# EAGLE design board (EAGLE 9.6.2)
CDESIGNER: Kihun Song; CNAME: IR-Controller-Board; CREVISION: V1.0
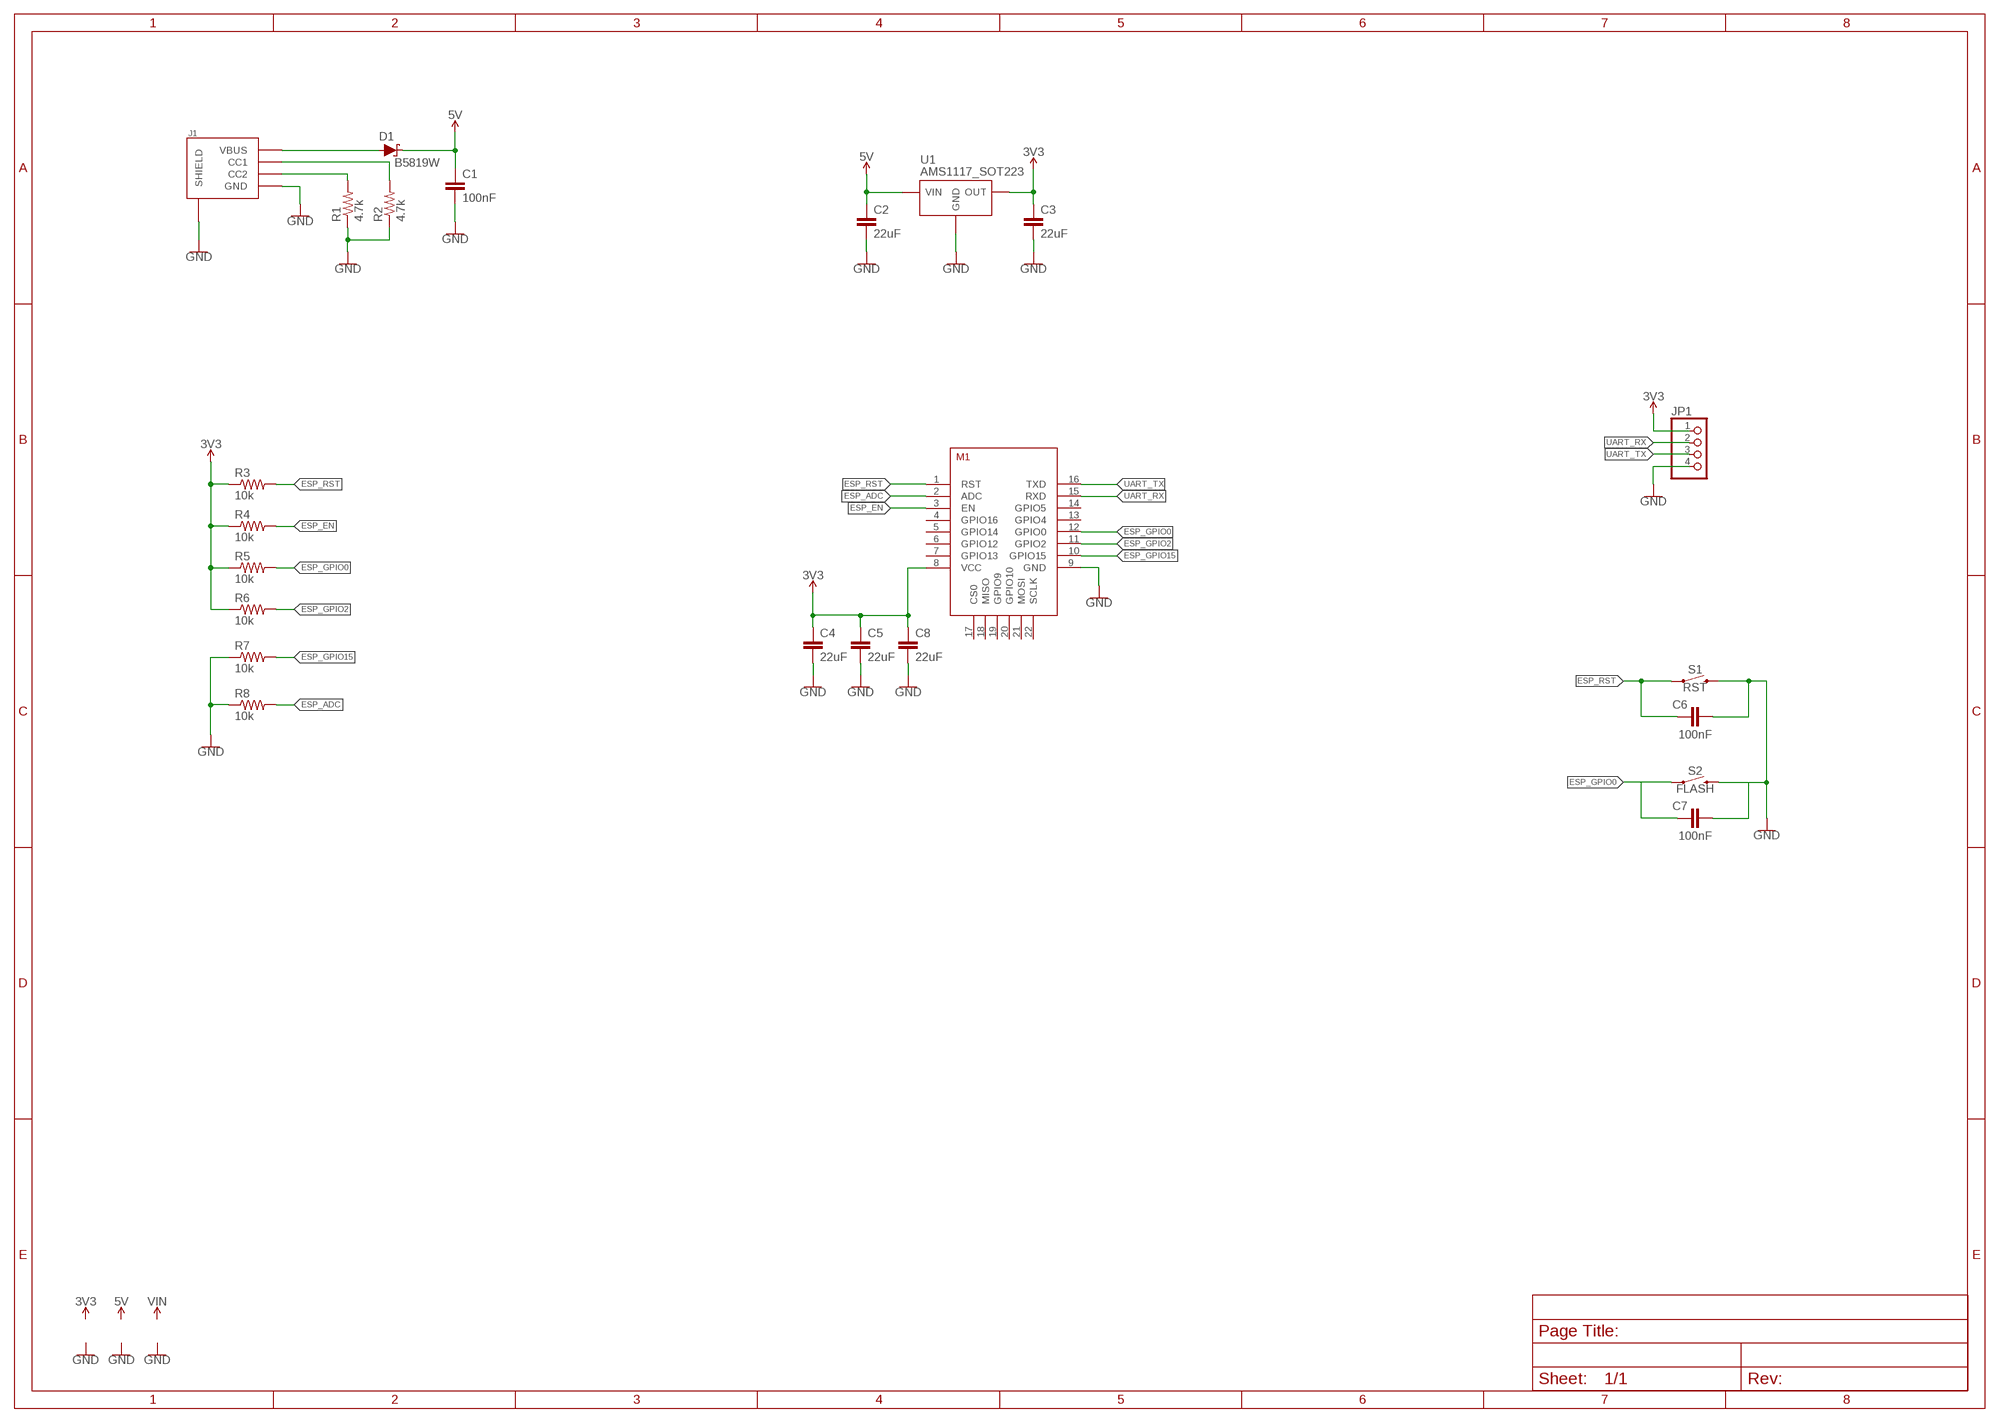
[diagram p0: schematic, sheet 1]

## Parts
C1  100nF  C-NON-POLC0402  [C0402]
C2  22uF  C-NON-POLC0805  [C0805]
C3  22uF  C-NON-POLC0805  [C0805]
C4  22uF  C-NON-POLC0805  [C0805]
C5  22uF  C-NON-POLC0805  [C0805]
C6  100nF  C-NON-POLC0402  [C0402]
C7  100nF  C-NON-POLC0402  [C0402]
C8  22uF  C-NON-POLC0805  [C0805]
D1  B5819W  DIODE-SCHOTTKY_SOD-123  [SOD-123]
J1  USB-TYPE-C-31-M-17  [USB-TYPE-C-31-M-17]
JP1  PINHD-1X4  [1X04]
M1  ESP8266-12E  [ESP8266-ESP12E]
R1  4.7k  RR0402  [R0402]
R2  4.7k  RR0402  [R0402]
R3  10k  RR0402  [R0402]
R4  10k  RR0402  [R0402]
R5  10k  RR0402  [R0402]
R6  10k  RR0402  [R0402]
R7  10k  RR0402  [R0402]
R8  10k  RR0402  [R0402]
S1  RST  SWITCH-SPST-SMD-3.0X4.0MM  [TACTILE_SWITCH_SMD_3.0X4.0MM]
S2  FLASH  SWITCH-SPST-SMD-3.0X4.0MM  [TACTILE_SWITCH_SMD_3.0X4.0MM]
U1  AMS1117_SOT223  [SOT-223]

## Nets
3V3 [power]: C3.1 C4.1 C5.1 C8.1 JP1.1 M1.8(VCC) R3.1 R4.1 R5.1 R6.1 U1.2(OUT) U1.4(OUT)
5V [power]: C1.1 C2.1 D1.C U1.3(VIN)
5V_IN1 [power]: D1.A J1.VBUS J1.VBUS_2(VBUS)
ESP_ADC: M1.2(ADC) R8.2
ESP_EN: M1.3(EN) R4.2
ESP_GPIO0: M1.12(GPIO0) R5.2 S2.1
ESP_GPIO2: M1.11(GPIO2) R6.2
ESP_GPIO15: M1.10(GPIO15) R7.2
ESP_RST: C6.1 M1.1(RST) R3.2 S1.1
ESP_RST1: C7.1
GND [power]: C1.2 C2.2 C3.2 C4.2 C5.2 C6.2 C8.2 J1.GND J1.GND_2(GND) J1.SHLD-B1(SHIELD) J1.SHLD-B2(SHIELD) J1.SHLD-B3(SHIELD) J1.SHLD-B4(SHIELD) J1.SHLD-T1(SHIELD) J1.SHLD-T2(SHIELD) J1.SHLD-T3(SHIELD) J1.SHLD-T4(SHIELD) JP1.4 M1.9(GND) R1.1 R2.1 R7.1 R8.1 S1.2 S2.2 U1.1(GND)
GND1 [power]: C7.2
N$1: J1.CC1 R2.2
N$2: J1.CC2 R1.2
UART_RX: JP1.2 M1.15(RXD)
UART_TX: JP1.3 M1.16(TXD)
Unconnected: M1.4(GPIO16) M1.5(GPIO14) M1.6(GPIO12) M1.7(GPIO13) M1.13(GPIO4) M1.14(GPIO5) M1.17(CS0) M1.18(MISO) M1.19(GPIO9) M1.20(GPIO10) M1.21(MOSI) M1.22(SCLK)

## Library data of the parts
C1 C6 C7 = angrypig7-RCL:C-NON-POL; LCSC: C1525; SPICEPREFIX: C
C2-C5 C8 = angrypig7-RCL:C-NON-POL; LCSC: C45783; SPICEPREFIX: C
D1 = angrypig7-Diodes:DIODE-SCHOTTKY; LCSC: C8598
J1 = angrypig7-Connectors-USB:USB-TYPE-C-31-M-17: Type-C-31-M16/17 By Korean Hroparts Elec link <https://lcsc.com/product-detail/Others_Korean-Hroparts-Elec-TYPE-C-31-M-17_C283540.html>
JP1 = angrypig7-Connectors-PinHeads:PINHD-1X4: PIN HEADER
M1 = angrypig7-Boards:ESP8266-12E
R1 R2 = angrypig7-RCL:R; LCSC: C25900; SPICEPREFIX: R
R3-R8 = angrypig7-RCL:R; SPICEPREFIX: R
S1 S2 = angrypig7-Switches:SWITCH-SPST; LCSC: C720477
U1 = angrypig7-IC-Power:AMS1117; LCSC: C6186

## Net classes
0 default: width 0.203 mm
1 power: width 0.406 mm

## Board
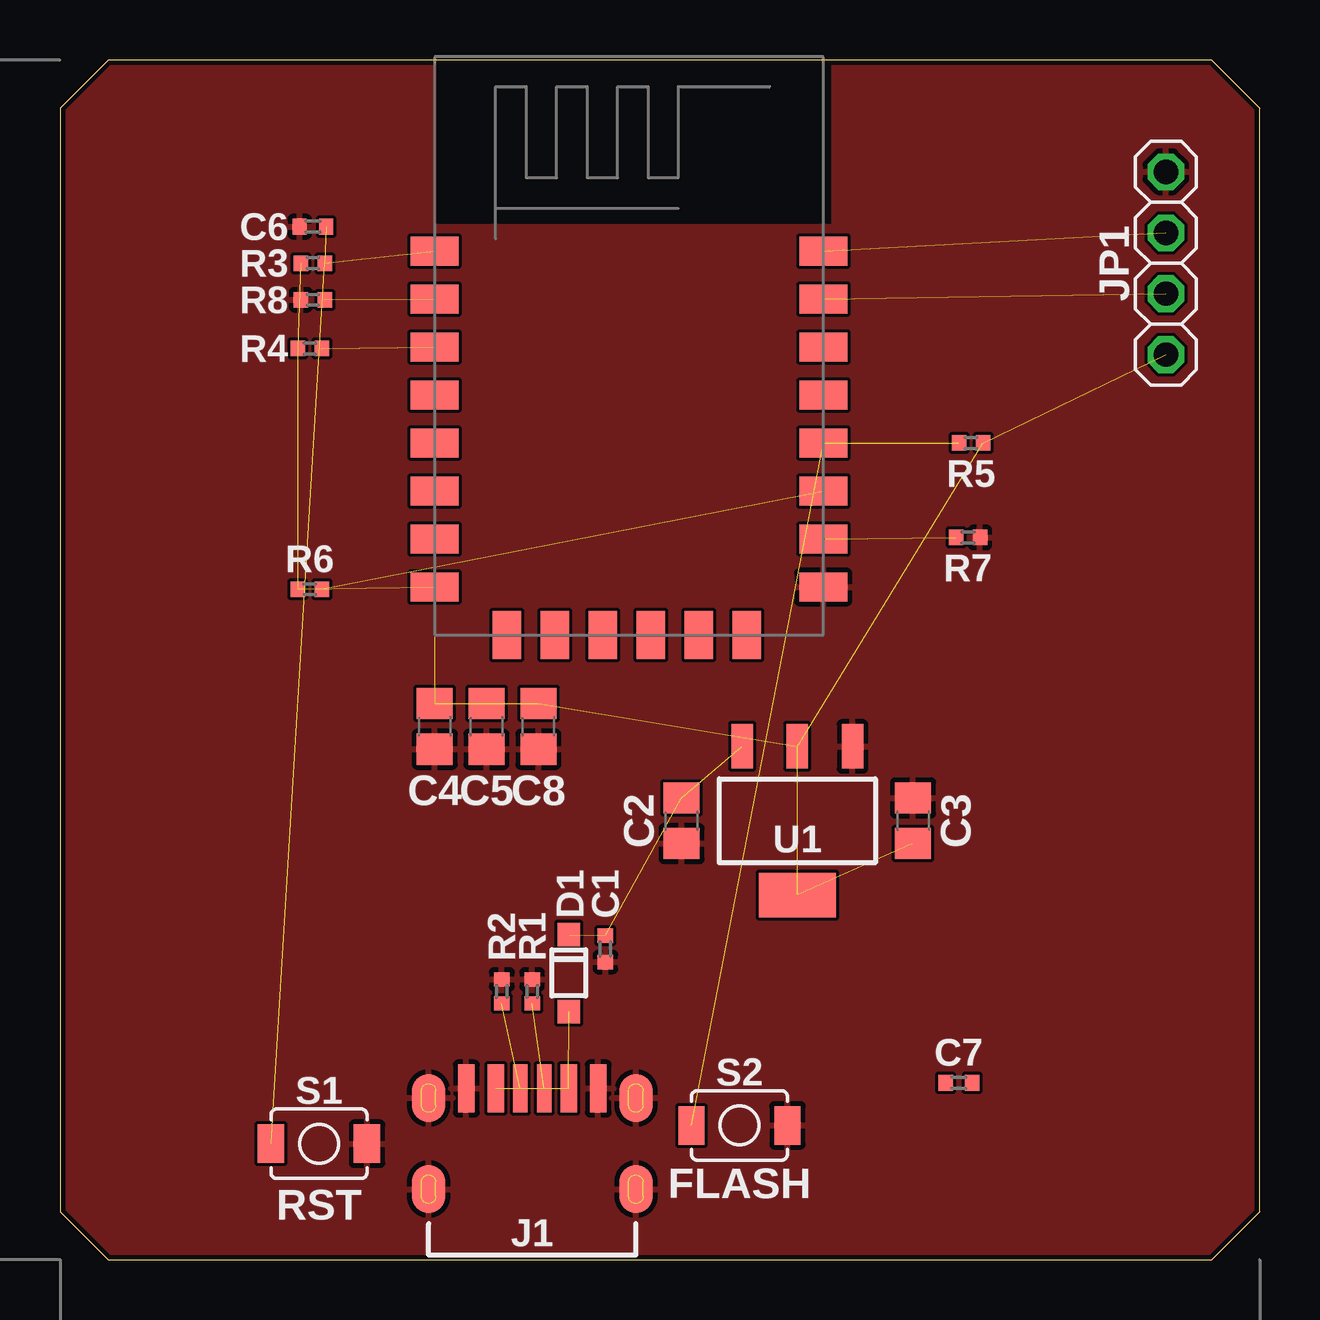
[diagram p1: board, top side]
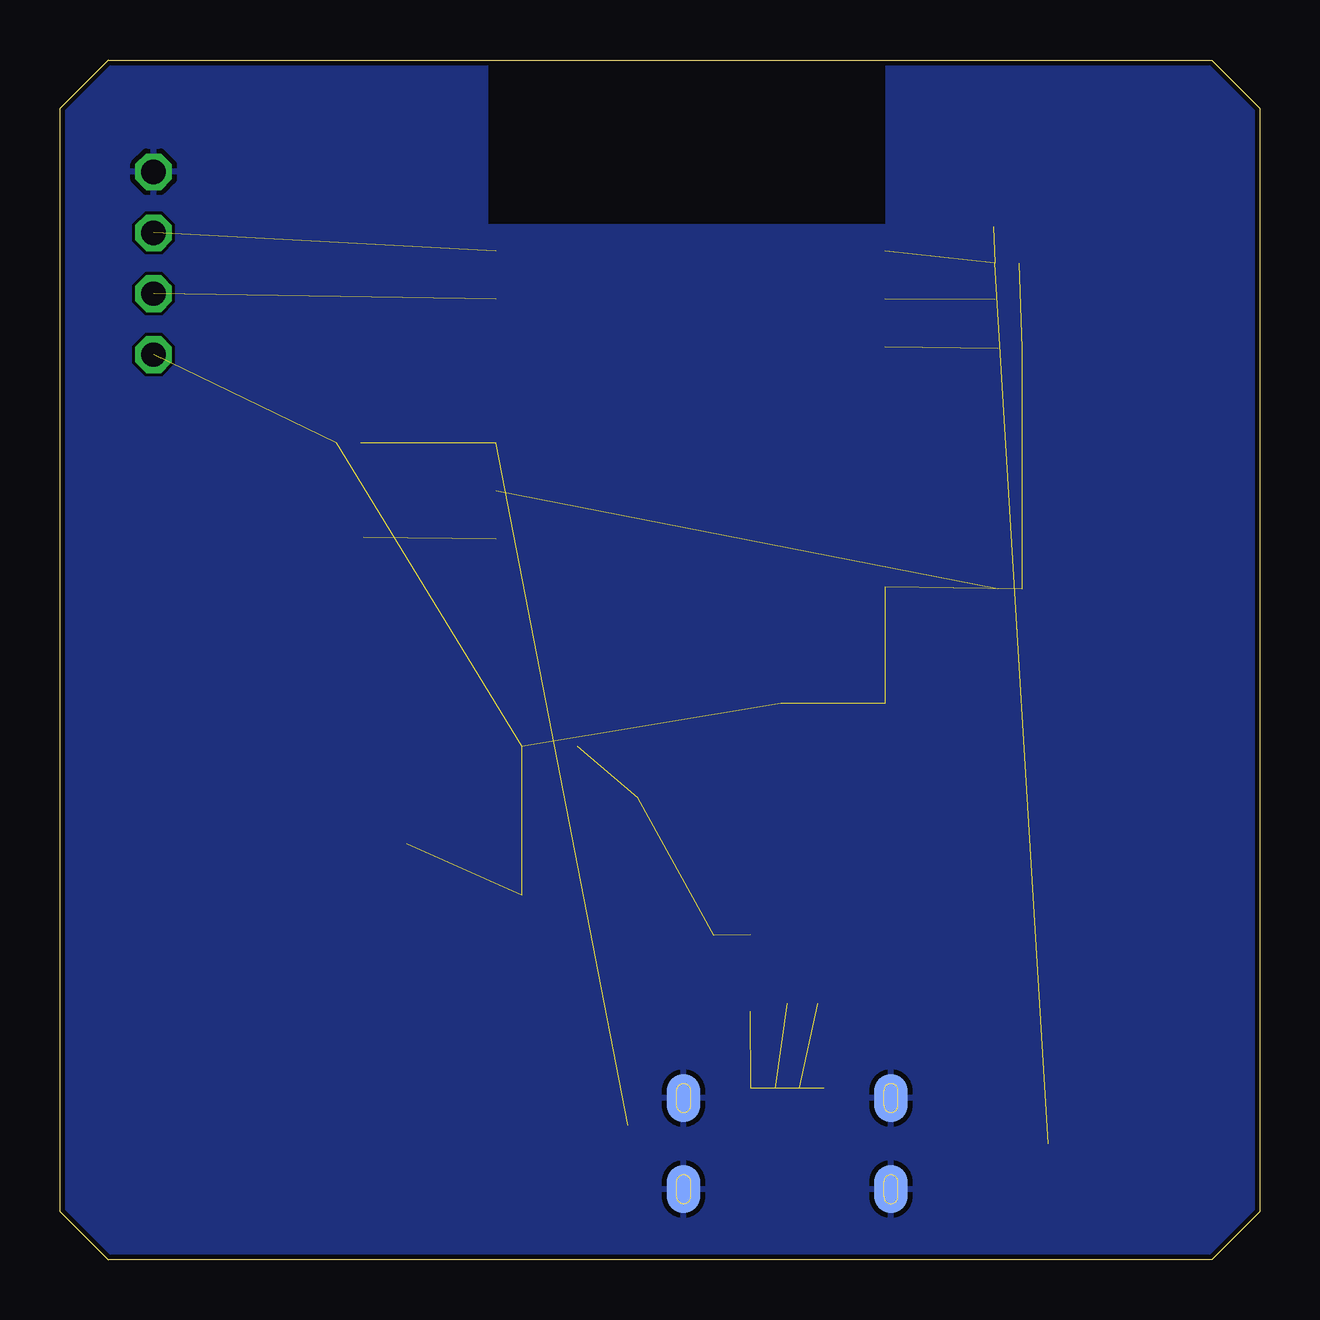
[diagram p2: board, bottom side, seen from below]

Size 50 x 50 mm. Coordinates in mm from the lower left corner, seen from the top.
Outline: 2,0 48,0 50,2 50,48 48,50 2,50 0,48 0,2 2,0
Copper layers (1*16): Top 0.035mm / dielectric 1.5mm / Bottom 0.035mm
Design rules "JLCPCB_2-Layer - safe": minimum track width 0.13208125mm, minimum drill 0.2mm, track to track 0.13208125mm, track to pad 0.13208125mm, pad to pad 0.13208125mm, via to via 0.13208125mm, smd to smd 0.13208125mm, copper to edge 8mil, drill to drill 3mil, minimum pad ring 3mil, minimum via ring 0.2mm, stop-mask expansion 4mil, vias tented up to drill 15mil, thermal gap 8mil

### Footprints (pad centres in the part's own frame; a part is rotated, then mirrored left to right if it is on the bottom)
C0402 = smd 0.6 x 0.65: 1 -0.551,0; 2 0.551,0
C0805 = smd 1.3 x 1.5: 1 -0.95,0; 2 0.95,0
SOD-123 = smd 0.988 x 0.95: A 1.6,0; C -1.6,0
USB-TYPE-C-31-M-17 = smd 0.6 x 2: CC1 -0.5,0.4; CC2 0.5,0.4 | smd 0.7 x 2: GND -2.75,0.4; GND_2 2.75,0.4; VBUS -1.52,0.4; VBUS_2 1.52,0.4 | smd 1.4 x 2 bottom: SHLD-B1 -4.32,0; SHLD-B2 4.32,0; SHLD-B3 -4.32,-3.8; SHLD-B4 4.32,-3.8 | smd 1.4 x 2: SHLD-T1 -4.32,0; SHLD-T2 4.32,0; SHLD-T3 -4.32,-3.8; SHLD-T4 4.32,-3.8
1X04 = drill 1.016 octagon: 1 -3.81,0; 2 -1.27,0; 3 1.27,0; 4 3.81,0
ESP8266-ESP12E = smd 2 x 1.2: 1 -7.62,5.84; 2 -7.62,3.84; 3 -7.62,1.84; 4 -7.62,-0.16; 5 -7.62,-2.16; 6 -7.62,-4.16; 7 -7.62,-6.16; 8 -7.62,-8.16; 9 8.58,-8.16; 10 8.58,-6.16; 11 8.58,-4.16; 12 8.58,-2.16; 13 8.58,-0.16; 14 8.58,1.84; 15 8.58,3.84; 16 8.58,5.84 | smd 1.2 x 2: 17 -4.62,-10.16; 18 -2.62,-10.16; 19 -0.62,-10.16; 20 1.38,-10.16; 21 3.38,-10.16; 22 5.38,-10.16
R0402 = smd 0.6 x 0.65: 1 -0.5,0; 2 0.5,0
TACTILE_SWITCH_SMD_3.0X4.0MM = smd 1.1 x 1.6: 1 -2,0; 2 2,0
SOT-223 = smd 1.85 x 0.9: 1 3.1,-2.3; 2 3.1,0; 3 3.1,2.3 | smd 1.85 x 3.2: 4 -3.1,0

### Placement (x,y rotation side)
C1  22.73,12.95 270 top
C2  25.91,18.29 270 top
C3  35.56,18.29 90 top
C4  15.62,22.23 270 top
C5  17.78,22.23 270 top
C6  10.54,43.05 180 top
C7  37.47,7.37 0 top
C8  19.94,22.23 270 top
D1  21.21,11.94 270 top
J1  19.68,6.73 0 top
JP1  46.1,41.53 90 top
M1  23.24,36.2 0 top
R1  19.68,11.18 270 top
R2  18.41,11.18 270 top
R3  10.54,41.53 0 top
R4  10.41,37.97 0 top
R5  37.97,34.04 180 top
R6  10.41,27.94 0 top
R7  37.85,30.1 180 top
R8  10.54,40.01 0 top
S1  10.79,4.83 0 top
S2  28.32,5.59 0 top
U1  30.73,18.29 90 top

### Tracks (layer width: path | path; a pad name or v marks a point on that pad's centre or on a via)
3V3  (11 unrouted)
5V  (3 unrouted)
5V_IN1  (2 unrouted)
ESP_ADC  (1 unrouted)
ESP_EN  (1 unrouted)
ESP_GPIO0  (2 unrouted)
ESP_GPIO2  (1 unrouted)
ESP_GPIO15  (1 unrouted)
ESP_RST  (3 unrouted)
GND
  pour Top: 0,50 50,50 50,0 0,0
  pour Bottom: 0,50 50,50 50,0 0,0
N$1  (1 unrouted)
N$2  (1 unrouted)
UART_RX  (1 unrouted)
UART_TX  (1 unrouted)

### Text on the board
tPlace: FLASH | RST